# EAGLE schematic ETH-IO_v2.1 (EAGLE 9.6.2)
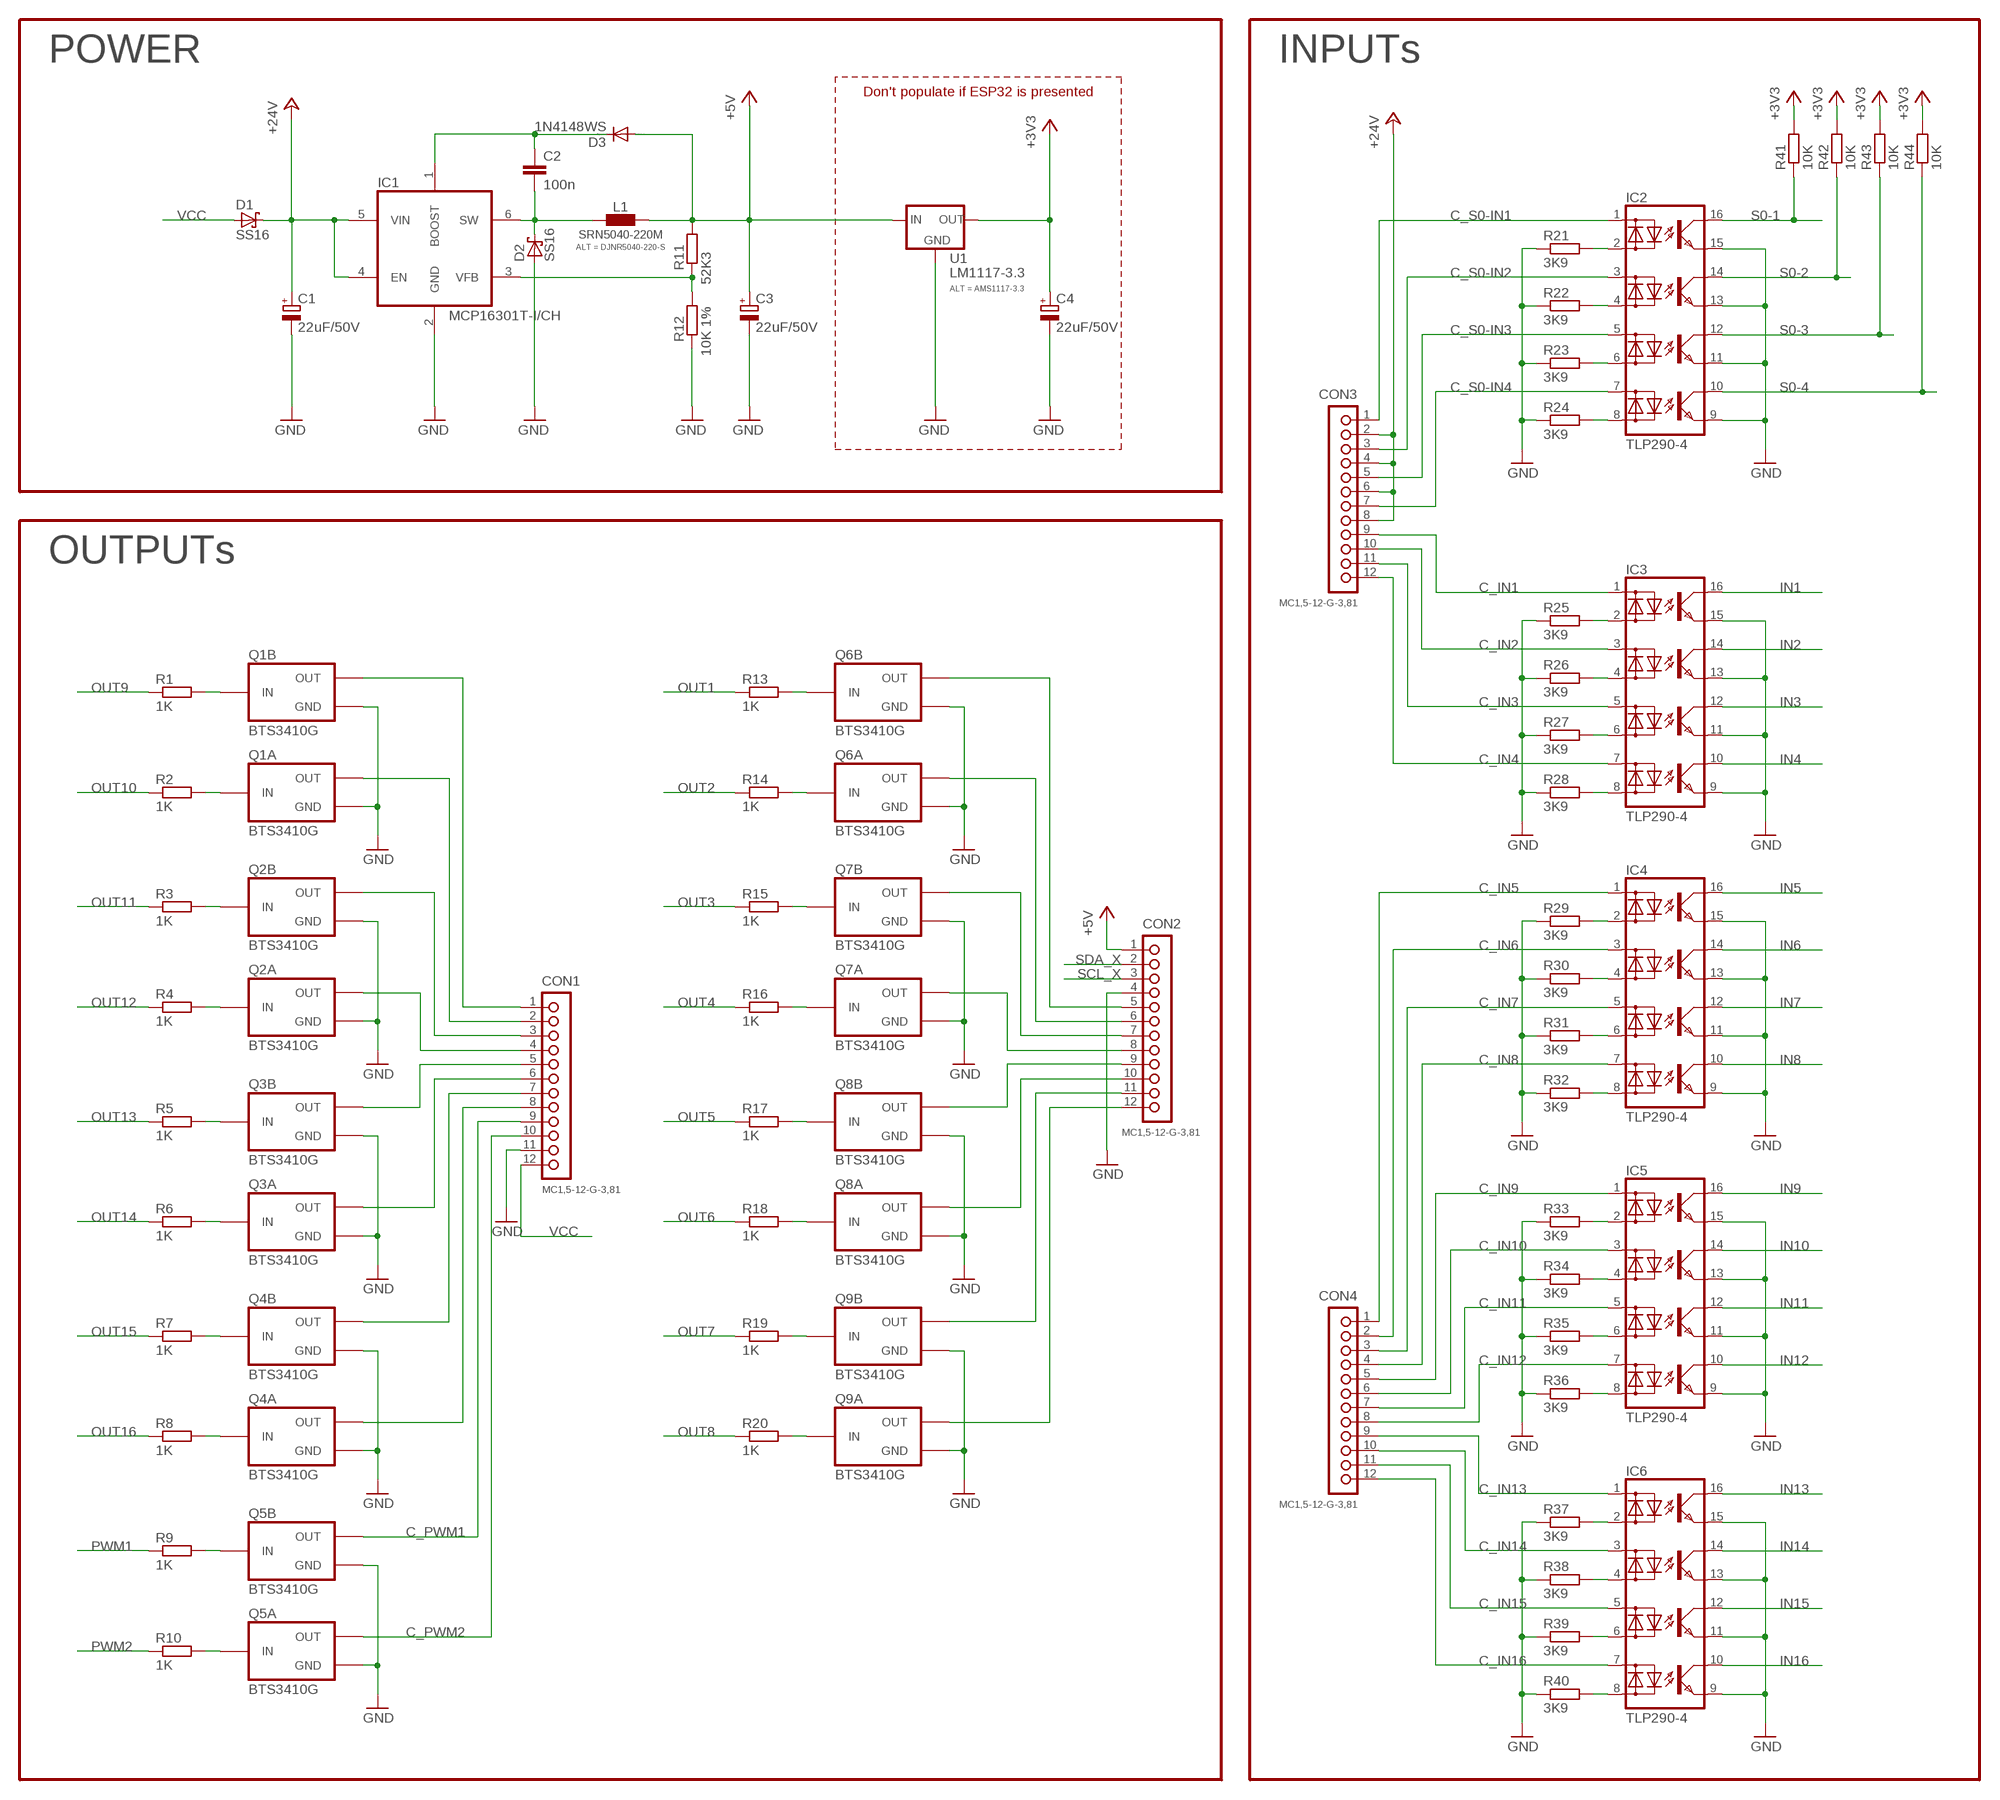
[diagram p0: schematic, sheet 1, part 1 of 2]
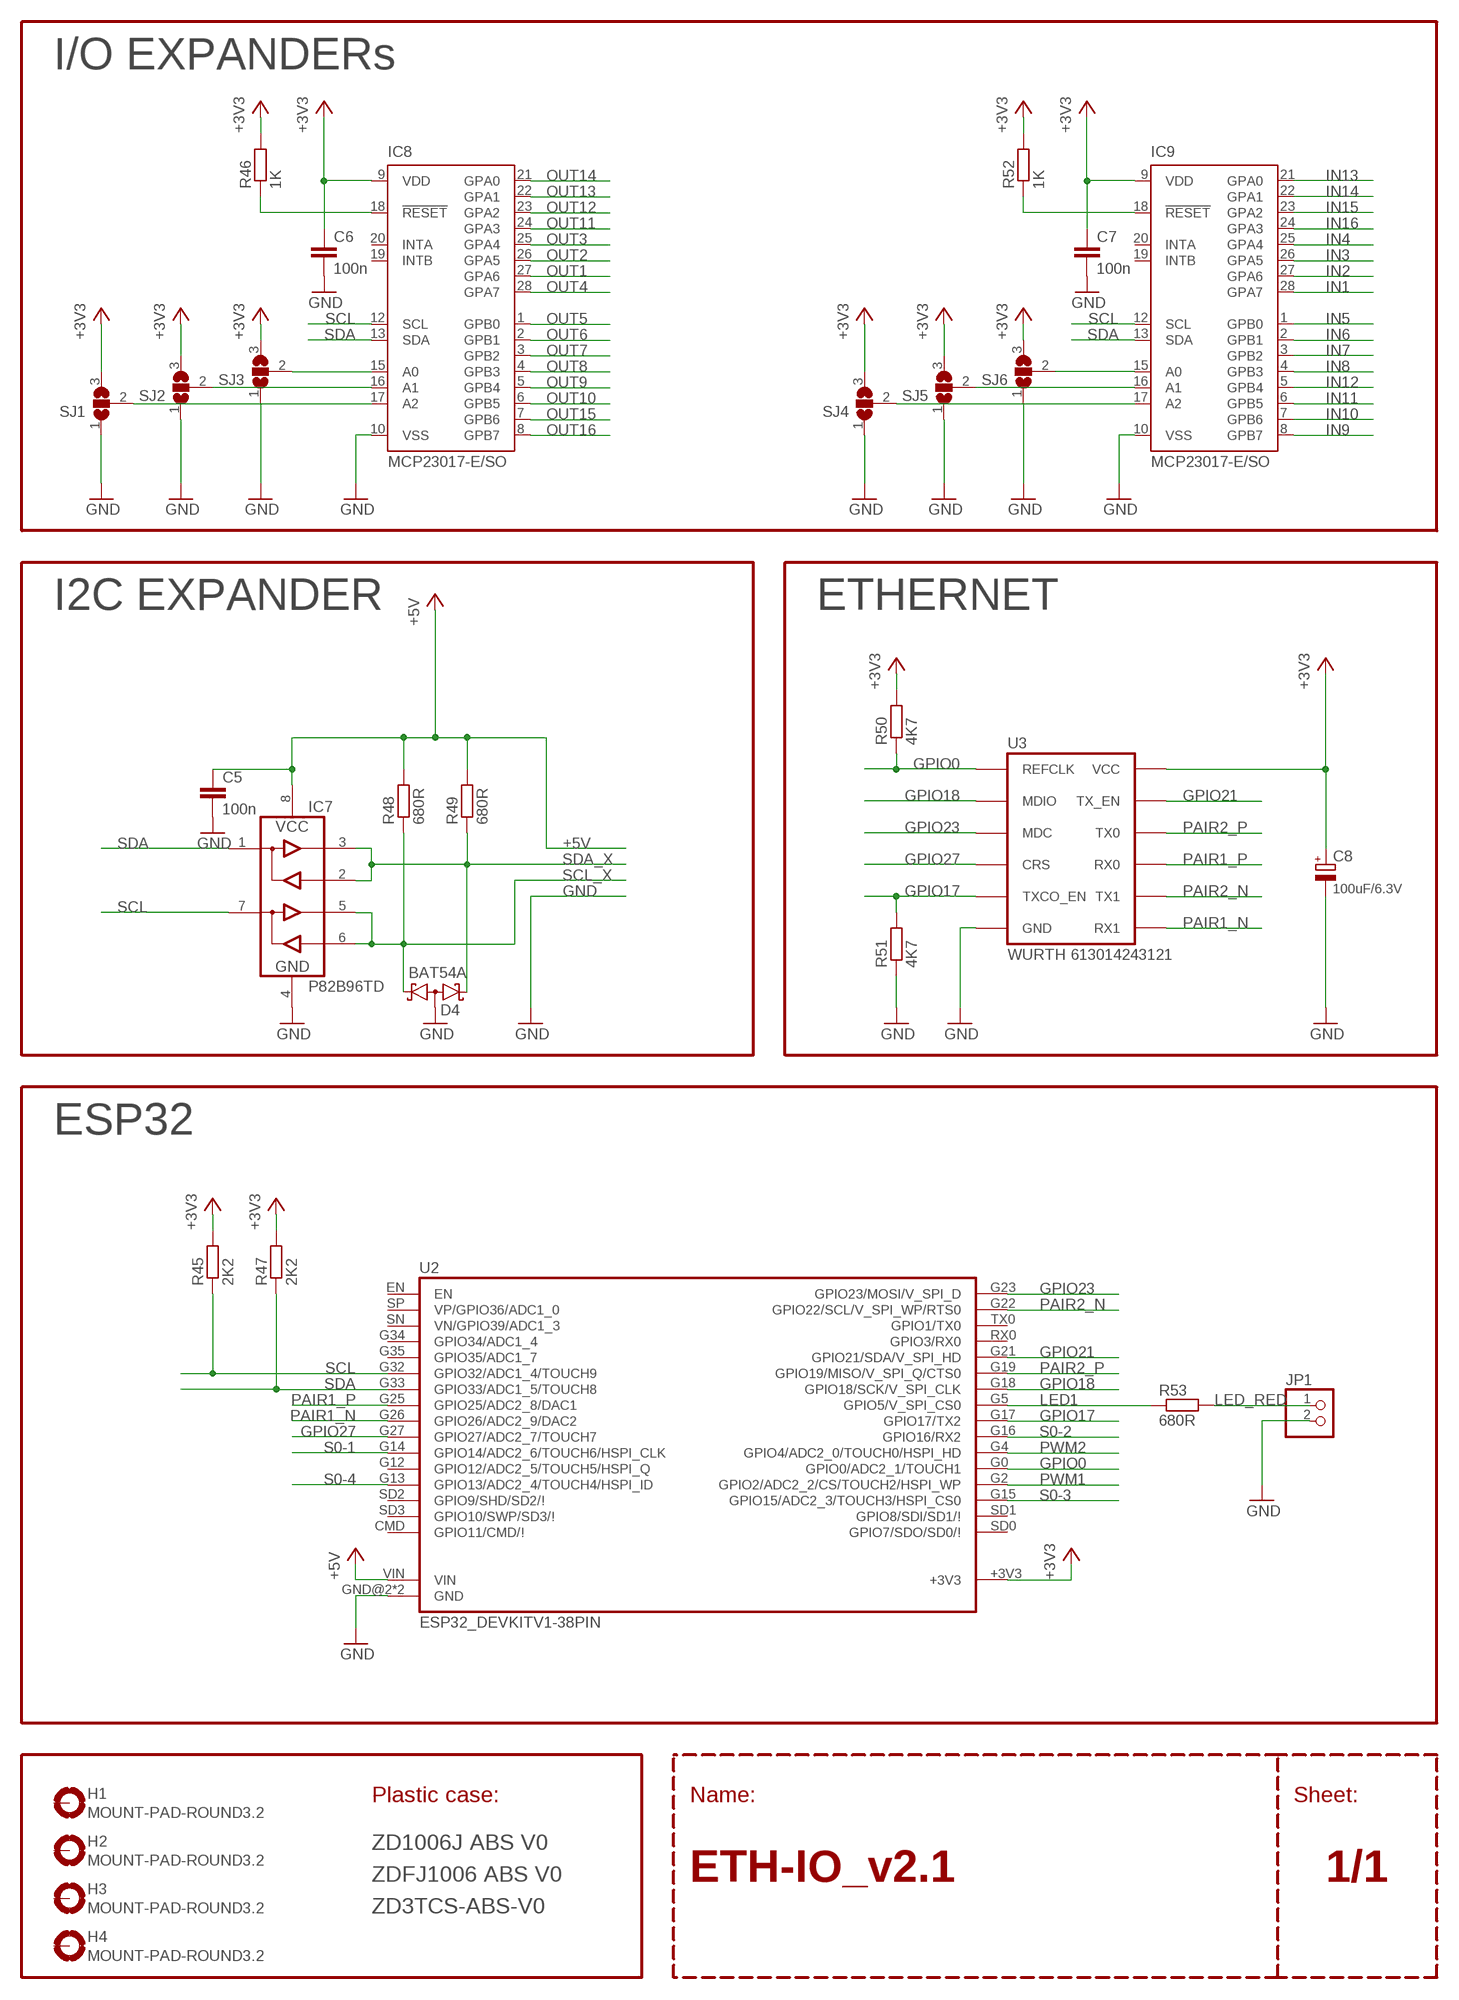
[diagram p1: schematic, sheet 1, part 2 of 2]

## Parts
C1  22uF/50V  CPOL-EUC  [PANASONIC_C]
C2  100n  C-EUC0805  [C0805]
C3  22uF/50V  CPOL-EUC  [PANASONIC_C]
C4  22uF/50V  CPOL-EUC  [PANASONIC_C]
C5  100n  C-EUC0805  [C0805]
C6  100n  C-EUC0805  [C0805]
C7  100n  C-EUC0805  [C0805]
C8  100uF/6.3V  CPOL-EUC  [PANASONIC_C]
CON1  MC1,5-12-G-3,81  [MC1,5/12-G-3,81]
CON2  MC1,5-12-G-3,81  [MC1,5/12-G-3,81]
CON3  MC1,5-12-G-3,81  [MC1,5/12-G-3,81]
CON4  MC1,5-12-G-3,81  [MC1,5/12-G-3,81]
D1  SS16  [DO214AC]
D2  SS16  SS14  [DO214AC]
D3  1N4148WS  [SOD323]
D4  BAT54A  [SOT23]
H1  MOUNT-PAD-ROUND3.2  [3,2-PAD]
H2  MOUNT-PAD-ROUND3.2  [3,2-PAD]
H3  MOUNT-PAD-ROUND3.2  [3,2-PAD]
H4  MOUNT-PAD-ROUND3.2  [3,2-PAD]
IC1  MCP16301T-I/CH  [SOT23-6]
IC2  TLP290-4  [SO16]
IC3  TLP290-4  [SO16]
IC4  TLP290-4  [SO16]
IC5  TLP290-4  [SO16]
IC6  TLP290-4  [SO16]
IC7  P82B96TD  [SO08]
IC8  MCP23017-E/SO  MCP23017SO  [SO28W]
IC9  MCP23017-E/SO  MCP23017SO  [SO28W]
JP1  PINHD-1X02_2.54-S  [1X02-S]
L1  SRN5040-220M  DJNR5040-220  [L5040]
Q1  BTS3410G  [SO8]
Q2  BTS3410G  [SO8]
Q3  BTS3410G  [SO8]
Q4  BTS3410G  [SO8]
Q5  BTS3410G  [SO8]
Q6  BTS3410G  [SO8]
Q7  BTS3410G  [SO8]
Q8  BTS3410G  [SO8]
Q9  BTS3410G  [SO8]
R1  1K  R-EU_R0805  [R0805]
R2  1K  R-EU_R0805  [R0805]
R3  1K  R-EU_R0805  [R0805]
R4  1K  R-EU_R0805  [R0805]
R5  1K  R-EU_R0805  [R0805]
R6  1K  R-EU_R0805  [R0805]
R7  1K  R-EU_R0805  [R0805]
R8  1K  R-EU_R0805  [R0805]
R9  1K  R-EU_R0805  [R0805]
R10  1K  R-EU_R0805  [R0805]
R11  52K3  R-EU_R0805  [R0805]
R12  10K 1%  R-EU_R0805  [R0805]
R13  1K  R-EU_R0805  [R0805]
R14  1K  R-EU_R0805  [R0805]
R15  1K  R-EU_R0805  [R0805]
R16  1K  R-EU_R0805  [R0805]
R17  1K  R-EU_R0805  [R0805]
R18  1K  R-EU_R0805  [R0805]
R19  1K  R-EU_R0805  [R0805]
R20  1K  R-EU_R0805  [R0805]
R21  3K9  R-EU_R0805  [R0805]
R22  3K9  R-EU_R0805  [R0805]
R23  3K9  R-EU_R0805  [R0805]
R24  3K9  R-EU_R0805  [R0805]
R25  3K9  R-EU_R0805  [R0805]
R26  3K9  R-EU_R0805  [R0805]
R27  3K9  R-EU_R0805  [R0805]
R28  3K9  R-EU_R0805  [R0805]
R29  3K9  R-EU_R0805  [R0805]
R30  3K9  R-EU_R0805  [R0805]
R31  3K9  R-EU_R0805  [R0805]
R32  3K9  R-EU_R0805  [R0805]
R33  3K9  R-EU_R0805  [R0805]
R34  3K9  R-EU_R0805  [R0805]
R35  3K9  R-EU_R0805  [R0805]
R36  3K9  R-EU_R0805  [R0805]
R37  3K9  R-EU_R0805  [R0805]
R38  3K9  R-EU_R0805  [R0805]
R39  3K9  R-EU_R0805  [R0805]
R40  3K9  R-EU_R0805  [R0805]
R41  10K  R-EU_R0805  [R0805]
R42  10K  R-EU_R0805  [R0805]
R43  10K  R-EU_R0805  [R0805]
R44  10K  R-EU_R0805  [R0805]
R45  2K2  R-EU_R0805  [R0805]
R46  1K  R-EU_R0805  [R0805]
R47  2K2  R-EU_R0805  [R0805]
R48  680R  R-EU_R0805  [R0805]
R49  680R  R-EU_R0805  [R0805]
R50  4K7  R-EU_R0805  [R0805]
R51  4K7  R-EU_R0805  [R0805]
R52  1K  R-EU_R0805  [R0805]
R53  680R  R-EU_R0805  [R0805]
SJ1  SJ2W  [SJ_2]
SJ2  SJ2W  [SJ_2]
SJ3  SJ2W  [SJ_2]
SJ4  SJ2W  [SJ_2]
SJ5  SJ2W  [SJ_2]
SJ6  SJ2W  [SJ_2]
U1  LM1117-3.3  [SOT223]
U2  ESP32_DEVKITV1-38PIN  [ESP32_DEVKITV1_38PIN]
U3  WURTH 613014243121  LAN8720_ETH_BOARD  [LAN8720_ETH_BOARD]

## Nets
+3V3 [PWR]: C4.+ C6.1 C7.1 C8.+ IC8.9(VDD) IC9.9(VDD) R41.2 R42.2 R43.2 R44.2 R45.2 R46.2 R47.2 R50.2 R52.2 SJ1.3 SJ2.3 SJ3.3 SJ4.3 SJ5.3 SJ6.3 U1.2(OUT) U1.4(OUT) U2.+3V3 U3.VCC U3.VCC@1(VCC)
+5V [PWR]: C3.+ C5.1 CON2.1 D3.A IC7.8(VCC) L1.1 R11.2 R48.2 R49.2 U1.3(IN) U2.VIN
+24V [PWR]: C1.+ CON3.2 CON3.4 CON3.6 CON3.8 D1.C IC1.4(EN) IC1.5(VIN)
C_IN1: CON3.9 IC3.1(A1)
C_IN2: CON3.10 IC3.3(A2)
C_IN3: CON3.11 IC3.5(A3)
C_IN4: CON3.12 IC3.7(A4)
C_IN5: CON4.1 IC4.1(A1)
C_IN6: CON4.2 IC4.3(A2)
C_IN7: CON4.3 IC4.5(A3)
C_IN8: CON4.4 IC4.7(A4)
C_IN9: CON4.5 IC5.1(A1)
C_IN10: CON4.6 IC5.3(A2)
C_IN11: CON4.7 IC5.5(A3)
C_IN12: CON4.8 IC5.7(A4)
C_IN13: CON4.9 IC6.1(A1)
C_IN14: CON4.10 IC6.3(A2)
C_IN15: CON4.11 IC6.5(A3)
C_IN16: CON4.12 IC6.7(A4)
C_OUT1: CON2.5 Q6.5(B:OUT) Q6.6(B:OUT)
C_OUT2: CON2.6 Q6.7(A:OUT) Q6.8(A:OUT)
C_OUT3: CON2.7 Q7.5(B:OUT) Q7.6(B:OUT)
C_OUT4: CON2.8 Q7.7(A:OUT) Q7.8(A:OUT)
C_OUT5: CON2.9 Q8.5(B:OUT) Q8.6(B:OUT)
C_OUT6: CON2.10 Q8.7(A:OUT) Q8.8(A:OUT)
C_OUT7: CON2.11 Q9.5(B:OUT) Q9.6(B:OUT)
C_OUT8: CON2.12 Q9.7(A:OUT) Q9.8(A:OUT)
C_OUT9: CON1.1 Q1.5(B:OUT) Q1.6(B:OUT)
C_OUT10: CON1.2 Q1.7(A:OUT) Q1.8(A:OUT)
C_OUT11: CON1.3 Q2.5(B:OUT) Q2.6(B:OUT)
C_OUT12: CON1.4 Q2.7(A:OUT) Q2.8(A:OUT)
C_OUT13: CON1.5 Q3.5(B:OUT) Q3.6(B:OUT)
C_OUT14: CON1.6 Q3.7(A:OUT) Q3.8(A:OUT)
C_OUT15: CON1.7 Q4.5(B:OUT) Q4.6(B:OUT)
C_OUT16: CON1.8 Q4.7(A:OUT) Q4.8(A:OUT)
C_PWM1: CON1.9 Q5.5(B:OUT) Q5.6(B:OUT)
C_PWM2: CON1.10 Q5.7(A:OUT) Q5.8(A:OUT)
C_S0-IN1: CON3.1 IC2.1(A1)
C_S0-IN2: CON3.3 IC2.3(A2)
C_S0-IN3: CON3.5 IC2.5(A3)
C_S0-IN4: CON3.7 IC2.7(A4)
GND [PWR]: C1.- C3.- C4.- C5.2 C6.2 C7.2 C8.- CON1.11 CON2.4 D2.A D4.3(AA) IC1.2(GND) IC2.9(EMIT4) IC2.11(EMIT3) IC2.13(EMIT2) IC2.15(EMIT1) IC3.9(EMIT4) IC3.11(EMIT3) IC3.13(EMIT2) IC3.15(EMIT1) IC4.9(EMIT4) IC4.11(EMIT3) IC4.13(EMIT2) IC4.15(EMIT1) IC5.9(EMIT4) IC5.11(EMIT3) IC5.13(EMIT2) IC5.15(EMIT1) IC6.9(EMIT4) IC6.11(EMIT3) IC6.13(EMIT2) IC6.15(EMIT1) IC7.4(GND) IC8.10(VSS) IC9.10(VSS) JP1.2 Q1.1(A:GND) Q1.3(B:GND) Q2.1(A:GND) Q2.3(B:GND) Q3.1(A:GND) Q3.3(B:GND) Q4.1(A:GND) Q4.3(B:GND) Q5.1(A:GND) Q5.3(B:GND) Q6.1(A:GND) Q6.3(B:GND) Q7.1(A:GND) Q7.3(B:GND) Q8.1(A:GND) Q8.3(B:GND) Q9.1(A:GND) Q9.3(B:GND) R12.1 R21.1 R22.1 R23.1 R24.1 R25.1 R26.1 R27.1 R28.1 R29.1 R30.1 R31.1 R32.1 R33.1 R34.1 R35.1 R36.1 R37.1 R38.1 R39.1 R40.1 R51.1 SJ1.1 SJ2.1 SJ3.1 SJ4.1 SJ5.1 SJ6.1 U1.1(GND) U2.GND@2(GND) U2.GND@3(GND) U3.GND U3.GND@1(GND)
GPIO0: R50.1 U2.G0(GPIO0/ADC2_1/TOUCH1) U3.INT(REFCLK)
GPIO17 [ETH]: R51.2 U2.G17(GPIO17/TX2) U3.TXCO_EN
GPIO18 [ETH]: U2.G18(GPIO18/SCK/V_SPI_CLK) U3.MDIO
GPIO21 [ETH]: U2.G21(GPIO21/SDA/V_SPI_HD) U3.TX_EN
GPIO23 [ETH]: U2.G23(GPIO23/MOSI/V_SPI_D) U3.MDC
GPIO27 [ETH]: U2.G27(GPIO27/ADC2_7/TOUCH7) U3.CRS
IN1: IC3.16(COL1) IC9.28(GPA7)
IN2: IC3.14(COL2) IC9.27(GPA6)
IN3: IC3.12(COL3) IC9.26(GPA5)
IN4: IC3.10(COL4) IC9.25(GPA4)
IN5: IC4.16(COL1) IC9.1(GPB0)
IN6: IC4.14(COL2) IC9.2(GPB1)
IN7: IC4.12(COL3) IC9.3(GPB2)
IN8: IC4.10(COL4) IC9.4(GPB3)
IN9: IC5.16(COL1) IC9.8(GPB7)
IN10: IC5.14(COL2) IC9.7(GPB6)
IN11: IC5.12(COL3) IC9.6(GPB5)
IN12: IC5.10(COL4) IC9.5(GPB4)
IN13: IC6.16(COL1) IC9.21(GPA0)
IN14: IC6.14(COL2) IC9.22(GPA1)
IN15: IC6.12(COL3) IC9.23(GPA2)
IN16: IC6.10(COL4) IC9.24(GPA3)
LED1: R53.1 U2.G5(GPIO5/V_SPI_CS0)
LED_RED: JP1.1 R53.2
N$1: IC9.15(A0) SJ6.2
N$2: IC8.16(A1) SJ2.2
N$3: Q1.2(A:IN) R2.2
N$4: Q1.4(B:IN) R1.2
N$5: IC8.18(!RESET) R46.1
N$6: IC9.18(!RESET) R52.1
N$7: IC8.15(A0) SJ3.2
N$8: Q5.4(B:IN) R9.2
N$9: Q5.2(A:IN) R10.2
N$10: IC9.16(A1) SJ5.2
N$11: IC3.2(C1) R25.2
N$12: IC3.4(C2) R26.2
N$13: IC3.6(C3) R27.2
N$14: IC3.8(C4) R28.2
N$15: IC4.2(C1) R29.2
N$16: IC4.4(C2) R30.2
N$17: IC4.6(C3) R31.2
N$18: IC4.8(C4) R32.2
N$19: IC5.2(C1) R33.2
N$20: IC5.4(C2) R34.2
N$21: IC5.6(C3) R35.2
N$22: IC5.8(C4) R36.2
N$23: IC6.2(C1) R37.2
N$24: IC6.4(C2) R38.2
N$25: IC6.6(C3) R39.2
N$26: IC6.8(C4) R40.2
N$27: IC9.17(A2) SJ4.2
N$28: Q2.4(B:IN) R3.2
N$29: Q2.2(A:IN) R4.2
N$30: IC8.17(A2) SJ1.2
N$32: Q3.4(B:IN) R5.2
N$33: Q3.2(A:IN) R6.2
N$36: Q4.4(B:IN) R7.2
N$37: Q4.2(A:IN) R8.2
N$38: IC2.2(C1) R21.2
N$40: Q6.4(B:IN) R13.2
N$41: Q6.2(A:IN) R14.2
N$44: Q7.4(B:IN) R15.2
N$45: Q7.2(A:IN) R16.2
N$48: Q8.4(B:IN) R17.2
N$49: Q8.2(A:IN) R18.2
N$52: Q9.4(B:IN) R19.2
N$53: Q9.2(A:IN) R20.2
N$55: IC2.4(C2) R22.2
N$56: IC2.6(C3) R23.2
N$57: IC2.8(C4) R24.2
N$67: C2.2 D2.C IC1.6(SW) L1.2
N$68: C2.1 D3.C IC1.1(BOOST)
N$69: IC1.3(VFB) R11.1 R12.2
OUT1: IC8.27(GPA6) R13.1
OUT2: IC8.26(GPA5) R14.1
OUT3: IC8.25(GPA4) R15.1
OUT4: IC8.28(GPA7) R16.1
OUT5: IC8.1(GPB0) R17.1
OUT6: IC8.2(GPB1) R18.1
OUT7: IC8.3(GPB2) R19.1
OUT8: IC8.4(GPB3) R20.1
OUT9: IC8.5(GPB4) R1.1
OUT10: IC8.6(GPB5) R2.1
OUT11: IC8.24(GPA3) R3.1
OUT12: IC8.23(GPA2) R4.1
OUT13: IC8.22(GPA1) R5.1
OUT14: IC8.21(GPA0) R6.1
OUT15: IC8.7(GPB6) R7.1
OUT16: IC8.8(GPB7) R8.1
PAIR1_N [RMII-RX]: U2.G26(GPIO26/ADC2_9/DAC2) U3.RX1
PAIR1_P [RMII-RX]: U2.G25(GPIO25/ADC2_8/DAC1) U3.RX0
PAIR2_N [RMII-TX]: U2.G22(GPIO22/SCL/V_SPI_WP/RTS0) U3.TX1
PAIR2_P [RMII-TX]: U2.G19(GPIO19/MISO/V_SPI_Q/CTS0) U3.TX0
PWM1: R9.1 U2.G2(GPIO2/ADC2_2/CS/TOUCH2/HSPI_WP)
PWM2: R10.1 U2.G4(GPIO4/ADC2_0/TOUCH0/HSPI_HD)
S0-1: IC2.16(COL1) R41.1 U2.G14(GPIO14/ADC2_6/TOUCH6/HSPI_CLK)
S0-2: IC2.14(COL2) R42.1 U2.G16(GPIO16/RX2)
S0-3: IC2.12(COL3) R43.1 U2.G15(GPIO15/ADC2_3/TOUCH3/HSPI_CS0)
S0-4: IC2.10(COL4) R44.1 U2.G13(GPIO13/ADC2_4/TOUCH4/HSPI_ID)
SCL [I2C]: IC7.7(SY) IC8.12(SCL) IC9.12(SCL) R45.1 U2.G32(GPIO32/ADC1_4/TOUCH9)
SCL_X [I2C_DIFF]: CON2.3 D4.1(K1) IC7.5(TY) IC7.6(RY) R48.1
SDA [I2C]: IC7.1(SX) IC8.13(SDA) IC9.13(SDA) R47.1 U2.G33(GPIO33/ADC1_5/TOUCH8)
SDA_X [I2C_DIFF]: CON2.2 D4.2(K2) IC7.2(RX) IC7.3(TX) R49.1
VCC: CON1.12 D1.A
Unconnected: H1.B3,2(MOUNT) H2.B3,2(MOUNT) H3.B3,2(MOUNT) H4.B3,2(MOUNT) IC8.19(INTB) IC8.20(INTA) IC9.19(INTB) IC9.20(INTA) U2.CMD(GPIO11/CMD/!) U2.EN U2.G12(GPIO12/ADC2_5/TOUCH5/HSPI_Q) U2.G34(GPIO34/ADC1_4) U2.G35(GPIO35/ADC1_7) U2.RX0(GPIO3/RX0) U2.SD0(GPIO7/SDO/SD0/!) U2.SD1(GPIO8/SDI/SD1/!) U2.SD2(GPIO9/SHD/SD2/!) U2.SD3(GPIO10/SWP/SD3/!) U2.SN(VN/GPIO39/ADC1_3) U2.SP(VP/GPIO36/ADC1_0) U2.TX0(GPIO1/TX0)

## Notes on the sheet
- POWER | INPUTs | I/O EXPANDERs
- Don't populate if ESP32 is presented
- I2C EXPANDER | ETHERNET
- OUTPUTs
- ESP32
- Plastic case: | Name: | Sheet:
- ZD1006J ABS V0
- ZDFJ1006 ABS V0 | ETH-IO_v2.1
- ZD3TCS-ABS-V0

## Library data of the parts
C1 C3 C4 C8 = rcl:CPOL-EU: POLARIZED CAPACITOR, European symbol; SPICEPREFIX: C
C2 C5-C7 = rcl:C-EU: CAPACITOR, European symbol; SPICEPREFIX: C
CON1-CON4 = my-con-terminal:MC1,5-12-G-?: 12P PCB plug-in terminal
D1 = my-diode:SS?*: Schottky Barrier Rectifier; A: 1; V: 60
D2 = my-diode:SS?*: Schottky Barrier Rectifier; A: 1; V: 40
D3 = my-diode:1N4148: Fast Switching Diode
D4 = diode:BAT54A: Schottky Diodes Source: Fairchild .. BAT54.pdf
H1-H4 = holes:MOUNT-PAD-ROUND: MOUNTING PAD, round
IC1 = my-power:MCP16301*T-I/?: High-Voltage Step-Down Regulator 4.0V to 30V / 4.7V to 36V (H)
IC2-IC6 = my-opto:TLP290-4: Quad Channel Optocoupler with diode
IC7 = my-ic:P82B96?: Dual bidirectional bus buffer; MSL: 1
IC8 IC9 = microchip:MCP23017: http://ww1.microchip.com/downloads/en/DeviceDoc/21952a.pdf Source: http://ww1.microchip.com/downloads/en/DeviceDoc/21952a.pdf; MF: MICROCHIP; MPN: MCP23017-E/SO; OC_FARNELL: 1332087; OC_NEWARK: 31K2958
JP1 = pinhead-2:PINHD-1X02: PIN HEADER
L1 = my-inductor:DJNR?-*: SMD Power Coil; ALT: DJNR5040-220-S; UH: 22
Q1-Q9 = my-load-switch:BTS3410G: Smart Low Side Power Switch
R1-R53 = rcl:R-EU_: RESISTOR, European symbol; SPICEPREFIX: R
SJ1-SJ6 = jumper:SJ2W: SMD solder JUMPER
U1 = my-power:LM1117-*: LDO regulator; ALT: AMS1117-3.3
U2 = tmp:ESP32_DEVKITV1-38PIN
U3 = my-modules:LAN8720_ETH_BOARD

## Net classes
0 default: width 0.254 mm, drill 0.5 mm
1 ETH: width 0.254 mm, drill 0.35 mm
2 RMII-TX: width 0.254 mm, drill 0.35 mm
3 RMII-RX: width 0.254 mm, drill 0.35 mm
4 I2C: width 0.254 mm, drill 0.35 mm
5 PWR: width 0.305 mm, drill 0.5 mm
6 I2C_DIFF: width 0.254 mm, drill 0.5 mm